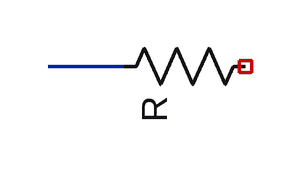
[diagram p0: schematic self.asc]
self.asc, the LTspice schematic file:
Version 4
SHEET 1 880 680
WIRE 100 100 150 100
SYMBOL res 246 84 R90

The netlist it stands for:
* self.asc
R§? NC_01 N001 R
.backanno
.end